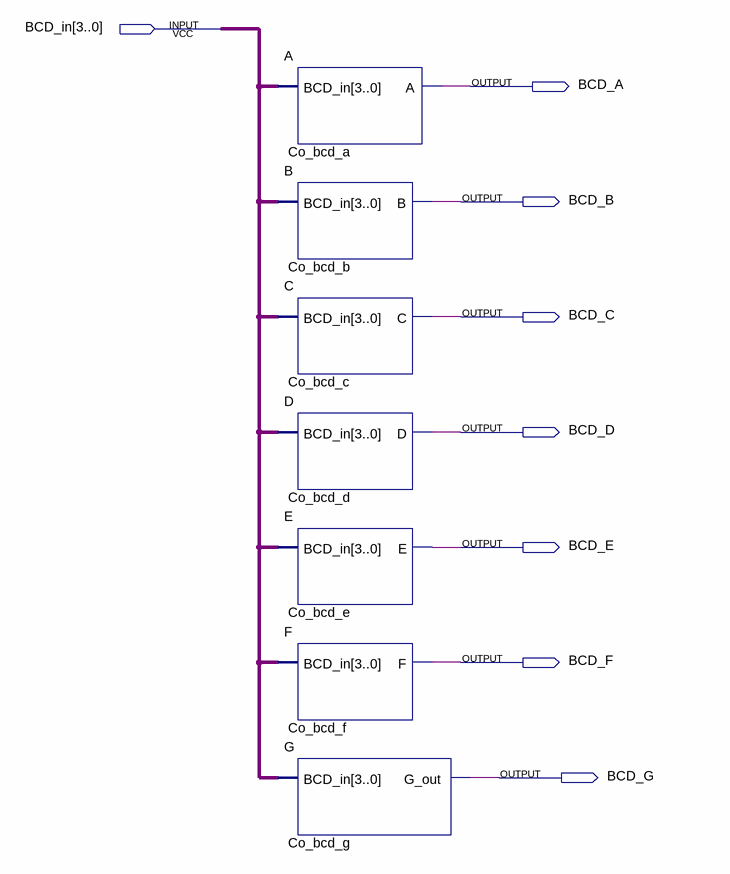
[diagram p0: schematic sheet]
// Quartus schematic bcd.bdf as structural Verilog: 7 symbols, 8 pins
module bcd (
  input  [3:0] BCD_in,
  output BCD_A,
  output BCD_B,
  output BCD_C,
  output BCD_D,
  output BCD_E,
  output BCD_F,
  output BCD_G
);

  A Co_bcd_a (.BCD_in(BCD_in), .A(BCD_A));
  B Co_bcd_b (.BCD_in(BCD_in), .B(BCD_B));
  C Co_bcd_c (.BCD_in(BCD_in), .C(BCD_C));
  D Co_bcd_d (.BCD_in(BCD_in), .D(BCD_D));
  E Co_bcd_e (.BCD_in(BCD_in), .E(BCD_E));
  F Co_bcd_f (.BCD_in(BCD_in), .F(BCD_F));
  G Co_bcd_g (.BCD_in(BCD_in), .G_out(BCD_G));
endmodule
